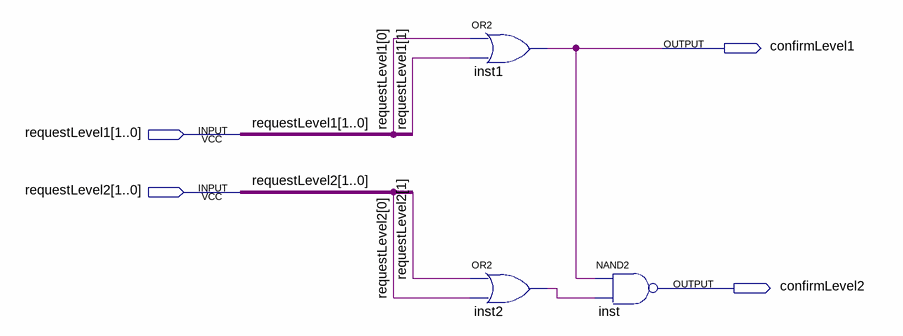
[diagram p0: schematic sheet]
// Quartus schematic Arbitrator.bdf as structural Verilog: 3 symbols, 4 pins
module Arbitrator (
  input  [1:0] requestLevel1,
  input  [1:0] requestLevel2,
  output confirmLevel1,
  output confirmLevel2
);

  wire inst2_out;

  or inst1 (confirmLevel1, requestLevel1[0], requestLevel1[1]);
  or inst2 (inst2_out, requestLevel2[1], requestLevel2[0]);
  nand inst (confirmLevel2, confirmLevel1, inst2_out);
endmodule
